# Altium schematic sheet interface.SchDoc
size 594 x 420 mm; SheetNumber: 3; SheetTotal: 5
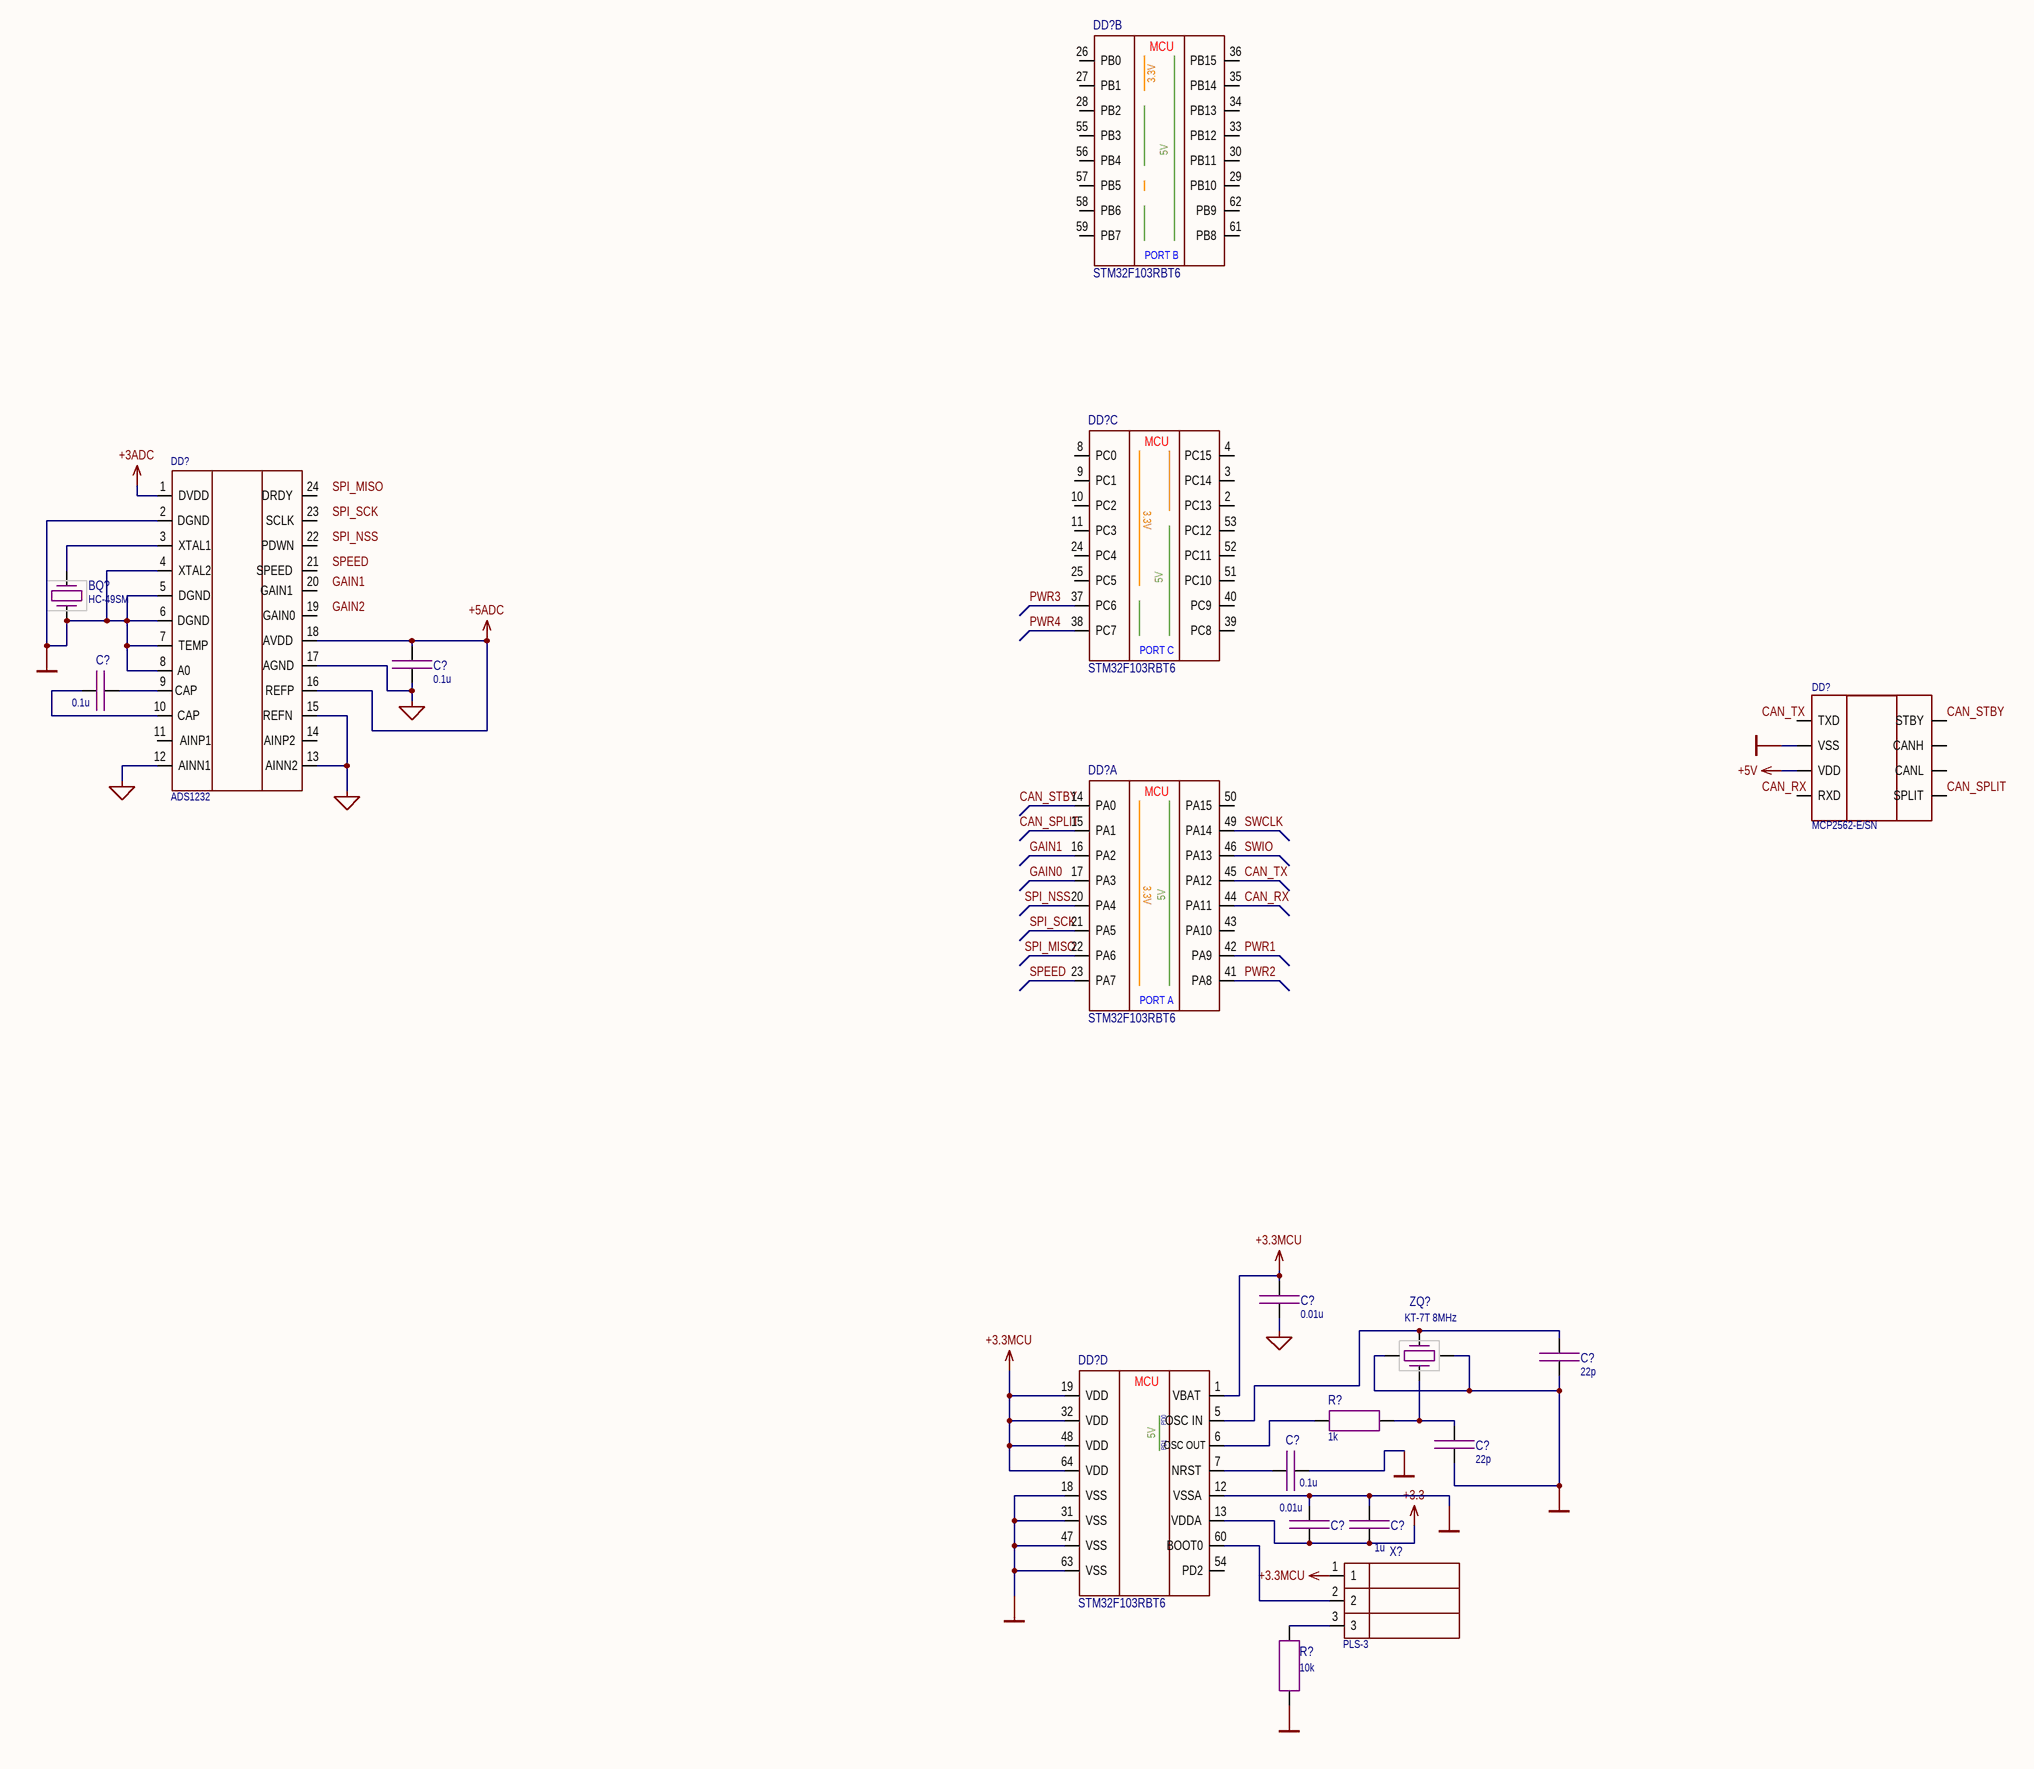
[diagram p0: interface.SchDoc]

## Parts
(Parts that share a designator on the sheet are numbered #1, #2 ... from top to bottom, then left to right.)
BQ?  HC-49SM  [CRYSTAL: HC-49SM]
C?#1  0.1u  [CAP: SMD 0603 MD IPC 782]
C?#2  0.1u  [CAP: SMD 0603 MD IPC 782]
C?#3  0.01u  [CAP: SMD 0603 MD IPC 782]
C?#4  22p  [CAP: SMD 0603 MD IPC 782]
C?#5  22p  [CAP: SMD 0603 MD IPC 782]
C?#6  0.1u  [CAP: SMD 0603 MD IPC 782]
C?#7  0.01u  [CAP: SMD 0603 MD IPC 782]
C?#8  1u  [CAP: SMD 0603 MD IPC 782]
DD?#1  STM32F103RBT6  [MC: LQFP-64]  (part B of 4)
DD?#2  STM32F103RBT6  [MC: LQFP-64]  (part C of 4)
DD?#3  ADS1232  [TSSOP-24]
DD?#4  MCP2562-E/SN
DD?#5  STM32F103RBT6  [MC: LQFP-64]  (part A of 4)
DD?#6  STM32F103RBT6  [MC: LQFP-64]  (part D of 4)
R?#1  1k  [RES: SMD 0603 MD IPC 782]
R?#2  10k  [RES: SMD 0603 MD IPC 782]
X?  PLS-3  [CON: 3pin PLS-3]
ZQ?  KT-7T 8MHz  [CRYSTAL: 3225 4pin]

## Nets
+3.3: C?#7.2 C?#8.2 DD?#6.13(VDDA)
+3.3MCU: C?#3.1 DD?#6.1(VBAT) DD?#6.19(VDD) DD?#6.32(VDD) DD?#6.48(VDD) DD?#6.64(VDD) X?.1
+3ADC: DD?#3.1(DVDD)
+5ADC: C?#1.2 DD?#3.16(REFP) DD?#3.18(AVDD)
+5V: DD?#4.3(VDD)
GNDD: BQ?.1 C?#4.2 C?#5.2 C?#6.1 C?#7.1 C?#8.1 DD?#3.2(DGND) DD?#3.4(XTAL2) DD?#3.5(DGND) DD?#3.6(DGND) DD?#3.7(TEMP) DD?#3.8(A0) DD?#4.2(VSS) DD?#6.12(VSSA) DD?#6.18(VSS) DD?#6.31(VSS) DD?#6.47(VSS) DD?#6.63(VSS) R?#2.1 ZQ?.2 ZQ?.4
NetC?#1_1: C?#1.1 C?#3.2 DD?#3.12(AINN1) DD?#3.13(AINN2) DD?#3.15(REFN) DD?#3.17(AGND)
CAN_RX: DD?#5.44(PA11)
CAN_SPLIT: DD?#4.8(SPLIT)
CAN_STBY: DD?#4.5(STBY)
CAN_TX: DD?#5.45(PA12)
GAIN0: DD?#5.17(PA3)
GAIN1: DD?#5.16(PA2)
PWR1: DD?#5.42(PA9)
PWR2: DD?#5.41(PA8)
PWR3: DD?#2.37(PC6)
PWR4: DD?#2.38(PC7)
SPEED: DD?#5.23(PA7)
SPI_SCK: DD?#5.21(PA5)
SWCLK: DD?#5.49(PA14)
SWIO: DD?#5.46(PA13)
NetBQ?_2: BQ?.2 DD?#3.3(XTAL1)
NetC?#2_1: C?#2.1 DD?#3.9(CAP)
NetC?#2_2: C?#2.2 DD?#3.10(CAP)
NetC?#4_1: C?#4.1 DD?#6.5(OSC_IN) ZQ?.3
NetC?#5_1: C?#5.1 R?#1.2 ZQ?.1
NetC?#6_2: C?#6.2 DD?#6.7(NRST)
NetDD?#6_6: DD?#6.6(OSC_OUT) R?#1.1
NetDD?#6_60: DD?#6.60(BOOT0) X?.2
NetR?#2_2: R?#2.2 X?.3

Not connected (* = marked no-connect by the designer): DD?#1 26(PB0) 27(PB1) 28(PB2) 29(PB10) 30(PB11) 33(PB12) 34(PB13) 35(PB14) 36(PB15) 55(PB3) 56(PB4) 57(PB5) 58(PB6) 59(PB7) 61(PB8) 62(PB9); DD?#2 2(PC13) 3(PC14) 4(PC15) 8(PC0) 9(PC1) 10(PC2) 11(PC3) 24(PC4) 25(PC5) 39(PC8) 40(PC9) 51(PC10) 52(PC11) 53(PC12); DD?#3 11(AINP1) 14(AINP2) 19(GAIN0) 20(GAIN1) 21(SPEED) 22(PDWN) 23(SCLK) 24(DRDY); DD?#4 1(TXD) 4(RXD) 6(CANH) 7(CANL); DD?#5 14(PA0) 15(PA1) 20(PA4) 22(PA6) 43(PA10) 50(PA15); DD?#6 54(PD2)

## Notes on the sheet
- Labels drawn without touching a wire or pin: CAN_RX, CAN_SPLIT, CAN_STBY, CAN_TX, GAIN1, GAIN2, SPEED, SPI_MISO, SPI_NSS, SPI_SCK
- Перв. примен.
- Справ. №
- Подп. и дата
- Инв. № дубл.
- Взам. инв. №
- Инв. № подл.
- Изм.
- Лист
- № докум.
- Подп.
- Дата
- 2.106-A2
- Копировал
- Формат А2
- (in symbol STM32F103 lqfp64 64kb, part A) MCU; 3.3V; 5V; PORT A
- (in symbol STM32F103 lqfp64 64kb, part B) MCU; 3.3V; 5V; PORT B
- (in symbol STM32F103 lqfp64 64kb, part C) MCU; 3.3V; 5V; PORT C
- (in symbol STM32F103 lqfp64 64kb, part D) MCU; PD0; 5V; PD1

## Library data of the parts
BQ? = SMD 4.9152MHz 2pin 10.3x4.5 16pF_1: Name: Резонатор кварцевый HC49SM 7.3728 MHz; Code: 6321974907; Parameter 1: 7.3728 MHz
C?#1 C?#2 C?#6 = 0.1u 50V 0603 ±10%: CC0603KRX7R9BB104; Code: 6279259871; Name: Конденсатор X7R 50V 0,1uF +-10% 0603
C?#3 C?#7 = 0.01u 100V 0603 ±10%: Code: 6270003321; Name: Конденсатор СС0603KRX7R0BB104, Yageo
C?#4 C?#5 = 22p 50V 0603 ±5%: Code: 6219310401; Name: Конденсатор 0603CG220J500NT, Fenghua
C?#8 = 1u 16V 0603 ±10%: Code: 62193105441; Name: Конденсатор 0603-NPO-25В-1000
DD?#1 DD?#2 DD?#5 DD?#6 = STM32F103 lqfp64 64kb: Code: 6335530806; Name: Микросхема STM32F103RBT6
DD?#4 = MCP2562-E/SN: MCP2562-E/SN, Высокоскоростной CAN трансивер
R?#1 = 1k ±1% 0603: Code: 6069174188; Name: Резистор 1k ±1% 0603
R?#2 = 10k ±1% 0603: Code: 6069191961; Name: Резистор 10K+-1% TK50 0603
X? = 3 in PLS 3: Code: 6313952321; Name: Вилка PLS-2
ZQ? = SMD 8MHz 4pin 3.2x2.5 22pF: Code: 6329545441; Name: Резонатор кварцевый KT-7X 8.0 MHz